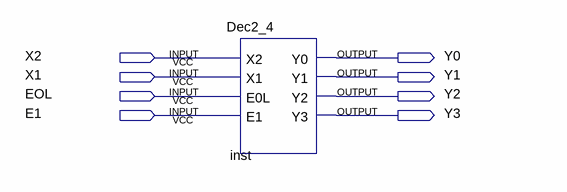
[diagram p0: schematic sheet]
// Quartus schematic DecoderDemo.bdf as structural Verilog: 1 symbols, 8 pins
module DecoderDemo (
  input  X2,
  input  X1,
  input  EOL,
  input  E1,
  output Y0,
  output Y1,
  output Y2,
  output Y3
);

  Dec2_4 inst (.X2(X2), .X1(X1), .E0L(EOL), .E1(E1), .Y0(Y0), .Y1(Y1), .Y2(Y2), .Y3(Y3));
endmodule
